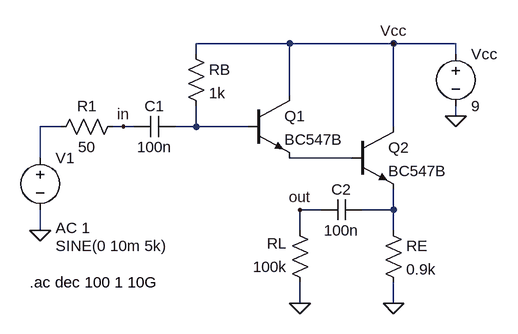
[diagram p0: schematic darlington.asc]
darlington.asc, the LTspice schematic file:
Version 4
SHEET 1 880 680
WIRE 176 32 32 32
WIRE 336 32 176 32
WIRE 432 32 336 32
WIRE 32 48 32 32
WIRE 432 48 432 32
WIRE 176 112 176 32
WIRE 432 144 432 128
WIRE -176 160 -208 160
WIRE -80 160 -96 160
WIRE -64 160 -80 160
WIRE 32 160 32 128
WIRE 32 160 0 160
WIRE 112 160 32 160
WIRE 336 160 336 32
WIRE -208 208 -208 160
WIRE 272 208 176 208
WIRE 224 288 192 288
WIRE 336 288 336 256
WIRE 336 288 288 288
WIRE -208 320 -208 288
WIRE 192 320 192 288
WIRE 336 320 336 288
WIRE 192 432 192 400
WIRE 336 432 336 400
FLAG 432 144 0
FLAG 336 432 0
FLAG 336 32 Vcc
FLAG 192 432 0
FLAG -208 320 0
FLAG -80 160 in
FLAG 192 288 out
SYMBOL npn 112 112 R0
SYMATTR InstName Q1
SYMATTR Value BC547B
SYMBOL npn 272 160 R0
SYMATTR InstName Q2
SYMATTR Value BC547B
SYMBOL res 16 32 R0
SYMATTR InstName RB
SYMATTR Value 1k
SYMBOL voltage 432 32 R0
WINDOW 123 0 0 Left 0
WINDOW 39 0 0 Left 0
SYMATTR InstName Vcc
SYMATTR Value 9
SYMBOL res 320 304 R0
SYMATTR InstName RE
SYMATTR Value 0.9k
SYMBOL cap 0 144 R90
WINDOW 0 0 32 VBottom 2
WINDOW 3 32 32 VTop 2
SYMATTR InstName C1
SYMATTR Value 100n
SYMBOL res -80 144 R90
WINDOW 0 0 56 VBottom 2
WINDOW 3 32 56 VTop 2
SYMATTR InstName R1
SYMATTR Value 50
SYMBOL res 208 416 R180
WINDOW 0 36 76 Left 2
WINDOW 3 36 40 Left 2
SYMATTR InstName RL
SYMATTR Value 100k
SYMBOL cap 288 272 R90
WINDOW 0 0 32 VBottom 2
WINDOW 3 32 32 VTop 2
SYMATTR InstName C2
SYMATTR Value 100n
SYMBOL voltage -208 192 R0
WINDOW 3 24 152 Left 2
WINDOW 123 24 124 Left 2
WINDOW 39 0 0 Left 0
SYMATTR Value SINE(0 10m 5k)
SYMATTR Value2 AC 1
SYMATTR InstName V1
TEXT -224 400 Left 2 !.ac dec 100 1 10G

The netlist it stands for:
* darlington.asc
Q1 Vcc N002 N003 0 BC547B
Q2 Vcc N003 N004 0 BC547B
RB Vcc N002 1k
Vcc Vcc 0 9
RE N004 0 0.9k
C1 N002 in 100n
R1 in N001 50
RL 0 out 100k
C2 N004 out 100n
V1 N001 0 SINE(0 10m 5k) AC 1
.model NPN NPN
.model PNP PNP
.lib standard.bjt
.ac dec 100 1 10G
.backanno
.end